# EAGLE board locux sodimm (EAGLE 6.1)
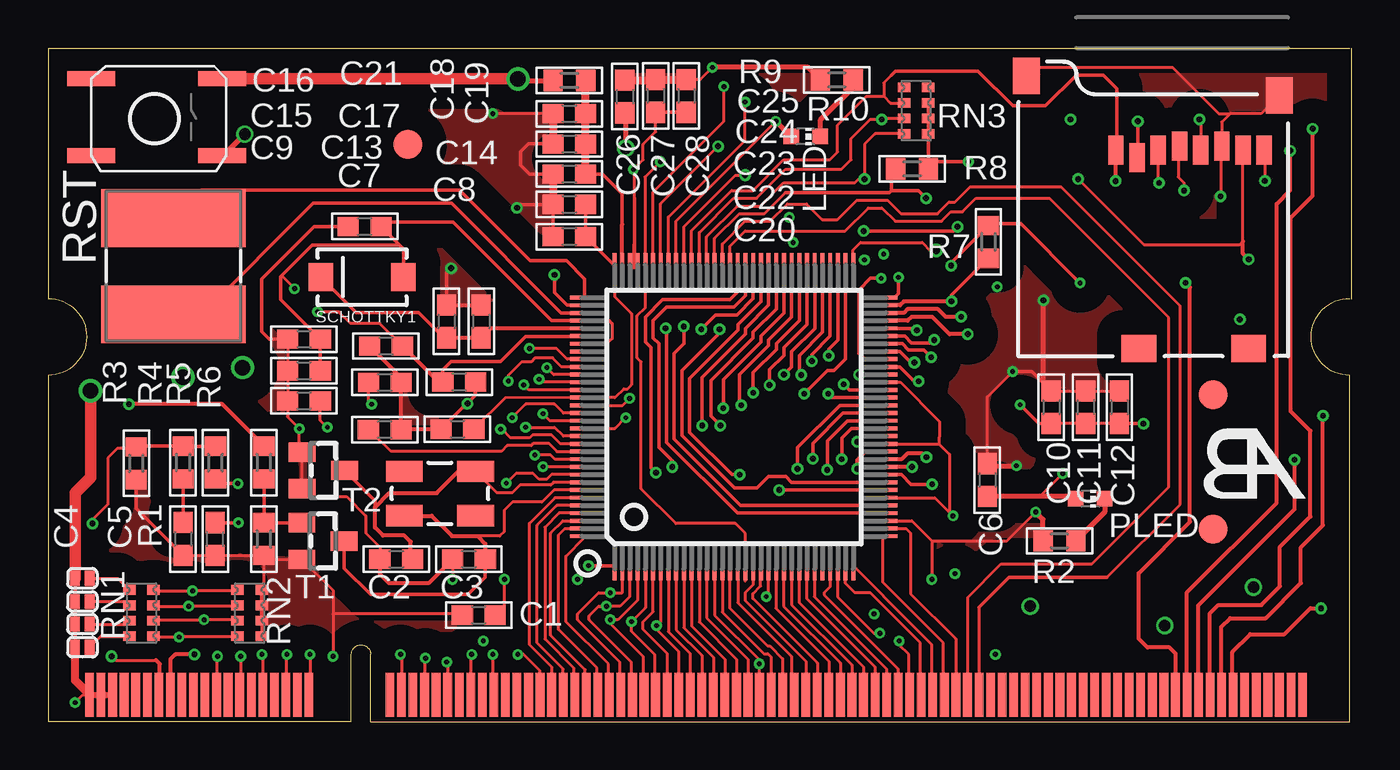
[diagram p2: board, top side]
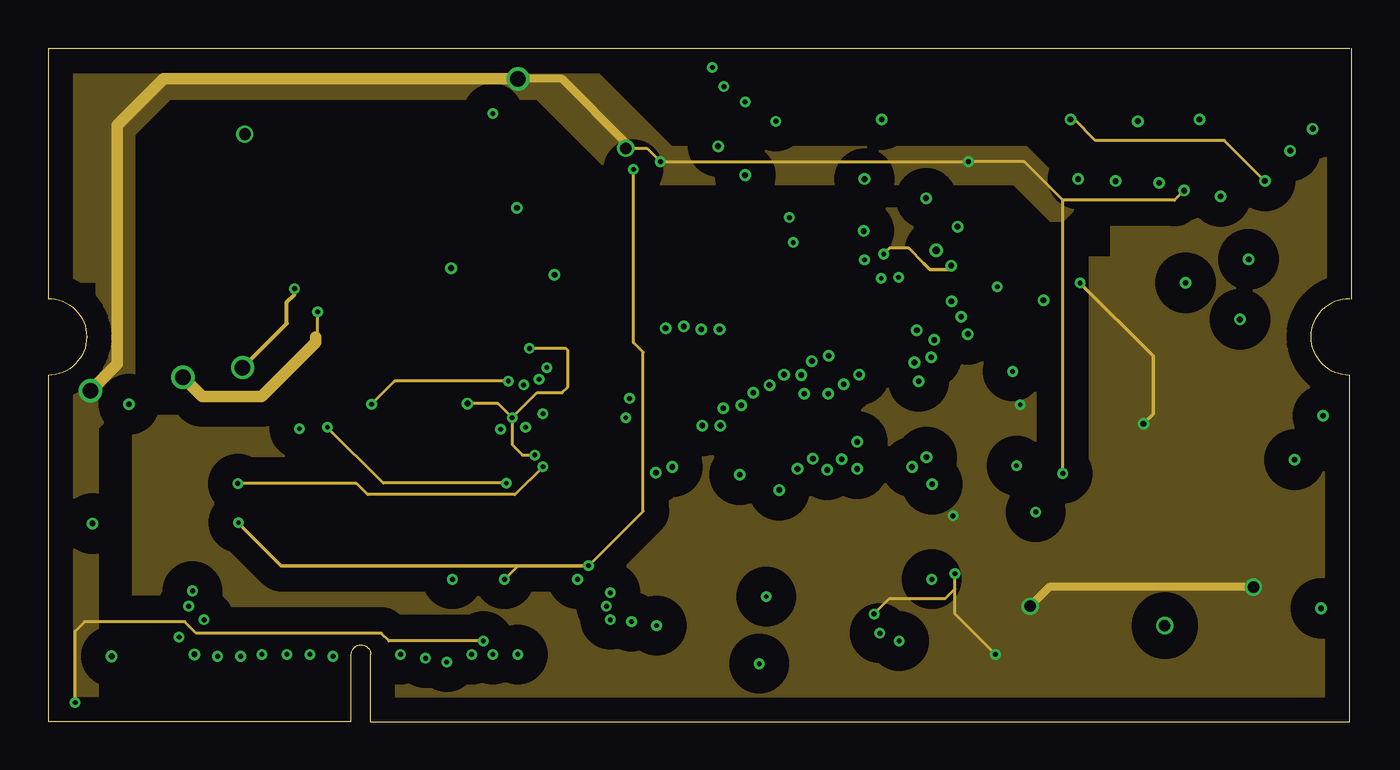
[diagram p3: board, inner layer POWER]
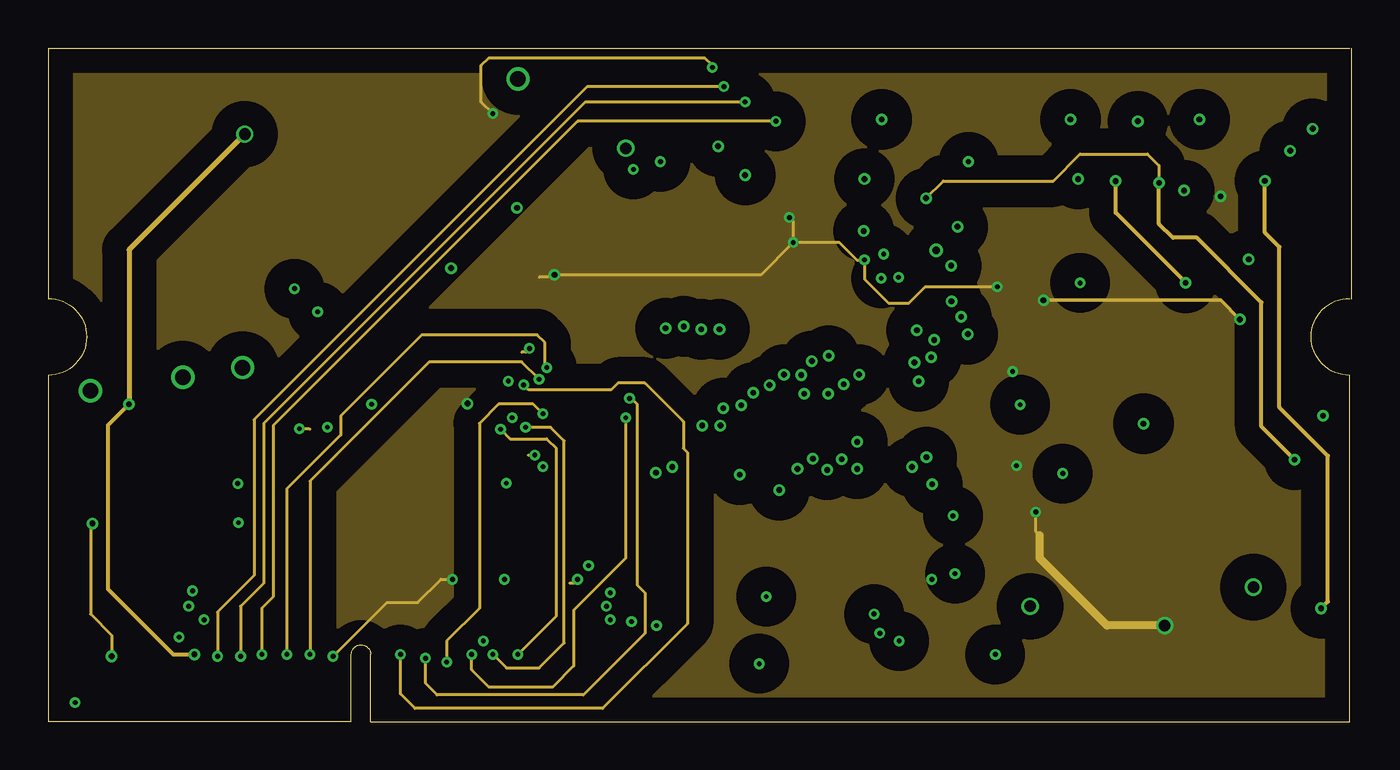
[diagram p4: board, inner layer GND]
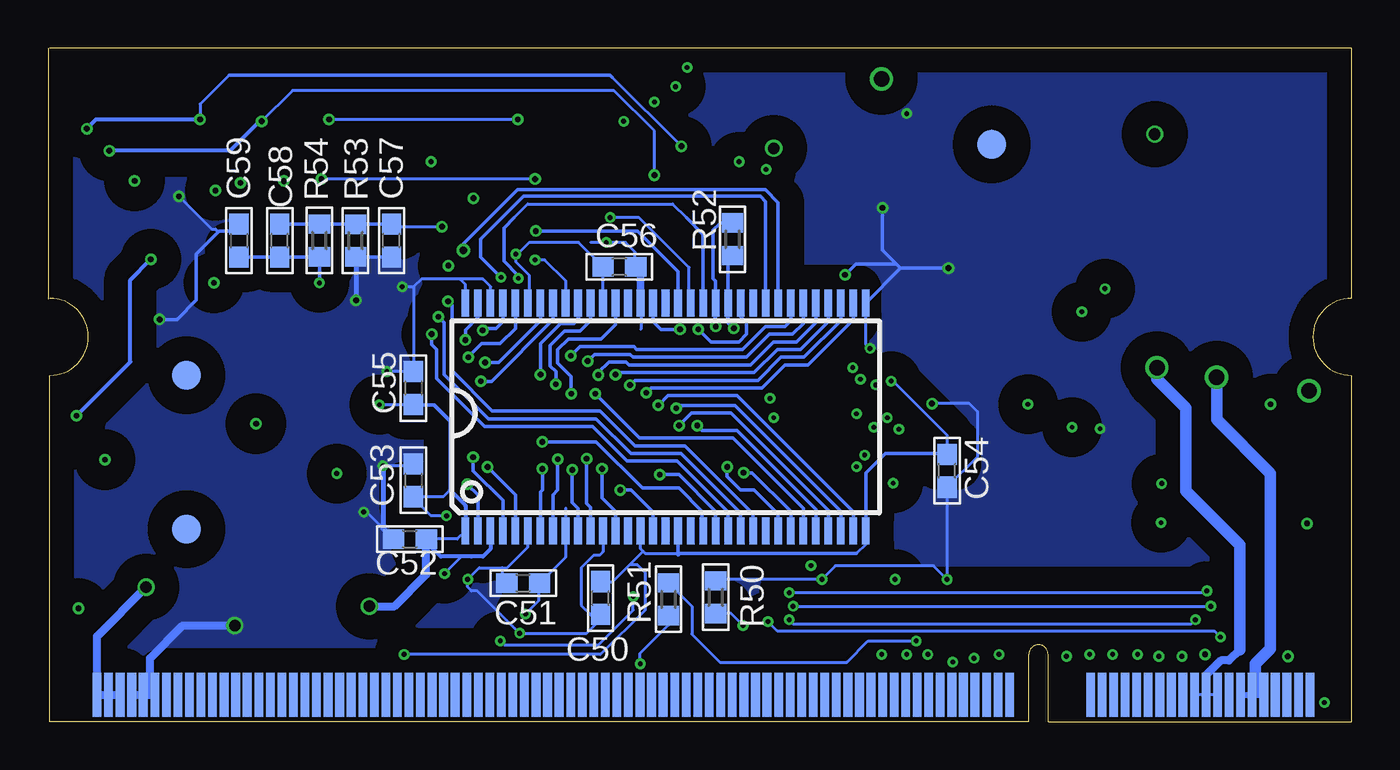
[diagram p5: board, bottom side, seen from below]

Size 67.69 x 35 mm. Coordinates in mm from the lower left corner, seen from the top.
Copper layers (1+2*15+16): SIG1 0.035mm / dielectric 0.5mm / POWER 0.035mm / dielectric 0.5mm / GND 0.035mm / dielectric 0.5mm / SIG2 0.035mm
Design rules: minimum track width 0.0051mm, minimum drill 0.25mm, track to track 0.1499mm, track to pad 0.1499mm, pad to pad 0.1499mm, via to via 0.1499mm, smd to smd 0.1mm, copper to edge 0.25mm, drill to drill 8mil, minimum pad ring 6mil, minimum via ring 0.15mm, stop-mask expansion 4mil, vias tented up to drill 25mil, thermal gap 0mil
Net classes: 1 pwr: width 0.15 mm, clearance 0.15 mm
tRestrict: 1 lines

## Footprints (pad centres in the part's own frame; a part is rotated, then mirrored left to right if it is on the bottom)
C0603 = smd 1.1 x 1: 1 -0.85,0; 2 0.85,0
SJ_1_SMALLER = smd 0.508 x 0.762: 1 -0.381,0; 2 0.381,0
FIDUCIAL-1.5X3 = smd 1.5 x 1.5: 1 0,0
NPI75C = smd 3 x 7.5: 1 -2.5,0; 2 2.5,0
CHIP-LED0603 = smd 0.8 x 0.8: A 0,-0.75; C 0,0.75
CRYSTAL-4PIN = smd 1.9 x 1.1: 1 -1.85,-1.15; 2 1.85,-1.15; 3 1.85,1.15; 4 -1.85,1.15
R0603 = smd 1 x 1.1: 1 -0.85,0; 2 0.85,0
0603-ARC = smd 0.5 x 0.65: 1 -1.2,-0.625; 2 -0.4,-0.625; 3 0.4,-0.625; 4 1.2,-0.625; 5 1.2,0.625; 6 0.4,0.625; 7 -0.4,0.625; 8 -1.2,0.625
SWITCH_SMD = smd 2.5 x 0.762: 1 -2.54,2.73; 2 4.26,2.73; 3 -2.54,-1.27; 4 4.26,-1.27
SCHOTTKY_SMA = smd 1.27 x 1.47: A -2.15,0; C 2.15,0
SODIMM_BOARD_SMALLER = smd 0.45 x 2.3: 1 2.15,1.4; 3 2.75,1.4; 5 3.35,1.4; 7 3.95,1.4; 9 4.55,1.4; 11 5.15,1.4; 13 5.75,1.4; 15 6.35,1.4; 17 6.95,1.4; 19 7.55,1.4; 21 8.15,1.4; 23 8.75,1.4; 25 9.35,1.4; 27 9.95,1.4; 29 10.55,1.4; 31 11.15,1.4; 33 11.75,1.4; 35 12.35,1.4; 37 12.95,1.4; 39 13.55,1.4; 41 17.75,1.4; 43 18.35,1.4; 45 18.95,1.4; 47 19.55,1.4; 49 20.15,1.4; 51 20.75,1.4; 53 21.35,1.4; 55 21.95,1.4; 57 22.55,1.4; 59 23.15,1.4; 61 23.75,1.4; 63 24.35,1.4; 65 24.95,1.4; 67 25.55,1.4; 69 26.15,1.4; 71 26.75,1.4; 73 27.35,1.4; 75 27.95,1.4; 77 28.55,1.4; 79 29.15,1.4; 81 29.75,1.4; 83 30.35,1.4; 85 30.95,1.4; 87 31.55,1.4; 89 32.15,1.4; 91 32.75,1.4; 93 33.35,1.4; 95 33.95,1.4; 97 34.55,1.4; 99 35.15,1.4; 101 35.75,1.4; 103 36.35,1.4; 105 36.95,1.4; 107 37.55,1.4; 109 38.15,1.4; 111 38.75,1.4; 113 39.35,1.4; 115 39.95,1.4; 117 40.55,1.4; 119 41.15,1.4; 121 41.75,1.4; 123 42.35,1.4; 125 42.95,1.4; 127 43.55,1.4; 129 44.15,1.4; 131 44.75,1.4; 133 45.35,1.4; 135 45.95,1.4; 137 46.55,1.4; 139 47.15,1.4; 141 47.75,1.4; 143 48.35,1.4; 145 48.95,1.4; 147 49.55,1.4; 149 50.15,1.4; 151 50.75,1.4; 153 51.35,1.4; 155 51.95,1.4; 157 52.55,1.4; 159 53.15,1.4; 161 53.75,1.4; 163 54.35,1.4; 165 54.95,1.4; 167 55.55,1.4; 169 56.15,1.4; 171 56.75,1.4; 173 57.35,1.4; 175 57.95,1.4; 177 58.55,1.4; 179 59.15,1.4; 181 59.75,1.4; 183 60.35,1.4; 185 60.95,1.4; 187 61.55,1.4; 189 62.15,1.4; 191 62.75,1.4; 193 63.35,1.4; 195 63.95,1.4; 197 64.55,1.4; 199 65.15,1.4 | smd 0.45 x 2.3 bottom: 2 2.15,1.4; 4 2.75,1.4; 6 3.35,1.4; 8 3.95,1.4; 10 4.55,1.4; 12 5.15,1.4; 14 5.75,1.4; 16 6.35,1.4; 18 6.95,1.4; 20 7.55,1.4; 22 8.15,1.4; 24 8.75,1.4; 26 9.35,1.4; 28 9.95,1.4; 30 10.55,1.4; 32 11.15,1.4; 34 11.75,1.4; 36 12.35,1.4; 38 12.95,1.4; 40 13.55,1.4; 42 17.75,1.4; 44 18.35,1.4; 46 18.95,1.4; 48 19.55,1.4; 50 20.15,1.4; 52 20.75,1.4; 54 21.35,1.4; 56 21.95,1.4; 58 22.55,1.4; 60 23.15,1.4; 62 23.75,1.4; 64 24.35,1.4; 66 24.95,1.4; 68 25.55,1.4; 70 26.15,1.4; 72 26.75,1.4; 74 27.35,1.4; 76 27.95,1.4; 78 28.55,1.4; 80 29.15,1.4; 82 29.75,1.4; 84 30.35,1.4; 86 30.95,1.4; 88 31.55,1.4; 90 32.15,1.4; 92 32.75,1.4; 94 33.35,1.4; 96 33.95,1.4; 98 34.55,1.4; 100 35.15,1.4; 102 35.75,1.4; 104 36.35,1.4; 106 36.95,1.4; 108 37.55,1.4; 110 38.15,1.4; 112 38.75,1.4; 114 39.35,1.4; 116 39.95,1.4; 118 40.55,1.4; 120 41.15,1.4; 122 41.75,1.4; 124 42.35,1.4; 126 42.95,1.4; 128 43.55,1.4; 130 44.15,1.4; 132 44.75,1.4; 134 45.35,1.4; 136 45.95,1.4; 138 46.55,1.4; 140 47.15,1.4; 142 47.75,1.4; 144 48.35,1.4; 146 48.95,1.4; 148 49.55,1.4; 150 50.15,1.4; 152 50.75,1.4; 154 51.35,1.4; 156 51.95,1.4; 158 52.55,1.4; 160 53.15,1.4; 162 53.75,1.4; 164 54.35,1.4; 166 54.95,1.4; 168 55.55,1.4; 170 56.15,1.4; 172 56.75,1.4; 174 57.35,1.4; 176 57.95,1.4; 178 58.55,1.4; 180 59.15,1.4; 182 59.75,1.4; 184 60.35,1.4; 186 60.95,1.4; 188 61.55,1.4; 190 62.15,1.4; 192 62.75,1.4; 194 63.35,1.4; 196 63.95,1.4; 198 64.55,1.4; 200 65.15,1.4
SOT23 = smd 1 x 1.4: 1 -0.95,-1.1; 2 0.95,-1.1; 3 0,1.1
TQFP128LD = smd 0.2 x 1.5: 1 -6.2,-7.75; 2 -5.8,-7.75; 3 -5.4,-7.75; 4 -5,-7.75; 5 -4.6,-7.75; 6 -4.2,-7.75; 7 -3.8,-7.75; 8 -3.4,-7.75; 9 -3,-7.75; 10 -2.6,-7.75; 11 -2.2,-7.75; 12 -1.8,-7.75; 13 -1.4,-7.75; 14 -1,-7.75; 15 -0.6,-7.75; 16 -0.2,-7.75; 17 0.2,-7.75; 18 0.6,-7.75; 19 1,-7.75; 20 1.4,-7.75; 21 1.8,-7.75; 22 2.2,-7.75; 23 2.6,-7.75; 24 3,-7.75; 25 3.4,-7.75; 26 3.8,-7.75; 27 4.2,-7.75; 28 4.6,-7.75; 29 5,-7.75; 30 5.4,-7.75; 31 5.8,-7.75; 32 6.2,-7.75; 65 6.2,7.75; 66 5.8,7.75; 67 5.4,7.75; 68 5,7.75; 69 4.6,7.75; 70 4.2,7.75; 71 3.8,7.75; 72 3.4,7.75; 73 3,7.75; 74 2.6,7.75; 75 2.2,7.75; 76 1.8,7.75; 77 1.4,7.75; 78 1,7.75; 79 0.6,7.75; 80 0.2,7.75; 81 -0.2,7.75; 82 -0.6,7.75; 83 -1,7.75; 84 -1.4,7.75; 85 -1.8,7.75; 86 -2.2,7.75; 87 -2.6,7.75; 88 -3,7.75; 89 -3.4,7.75; 90 -3.8,7.75; 91 -4.2,7.75; 92 -4.6,7.75; 93 -5,7.75; 94 -5.4,7.75; 95 -5.8,7.75; 96 -6.2,7.75 | smd 1.5 x 0.2: 33 7.75,-6.2; 34 7.75,-5.8; 35 7.75,-5.4; 36 7.75,-5; 37 7.75,-4.6; 38 7.75,-4.2; 39 7.75,-3.8; 40 7.75,-3.4; 41 7.75,-3; 42 7.75,-2.6; 43 7.75,-2.2; 44 7.75,-1.8; 45 7.75,-1.4; 46 7.75,-1; 47 7.75,-0.6; 48 7.75,-0.2; 49 7.75,0.2; 50 7.75,0.6; 51 7.75,1; 52 7.75,1.4; 53 7.75,1.8; 54 7.75,2.2; 55 7.75,2.6; 56 7.75,3; 57 7.75,3.4; 58 7.75,3.8; 59 7.75,4.2; 60 7.75,4.6; 61 7.75,5; 62 7.75,5.4; 63 7.75,5.8; 64 7.75,6.2; 97 -7.75,6.2; 98 -7.75,5.8; 99 -7.75,5.4; 100 -7.75,5; 101 -7.75,4.6; 102 -7.75,4.2; 103 -7.75,3.8; 104 -7.75,3.4; 105 -7.75,3; 106 -7.75,2.6; 107 -7.75,2.2; 108 -7.75,1.8; 109 -7.75,1.4; 110 -7.75,1; 111 -7.75,0.6; 112 -7.75,0.2; 113 -7.75,-0.2; 114 -7.75,-0.6; 115 -7.75,-1; 116 -7.75,-1.4; 117 -7.75,-1.8; 118 -7.75,-2.2; 119 -7.75,-2.6; 120 -7.75,-3; 121 -7.75,-3.4; 122 -7.75,-3.8; 123 -7.75,-4.2; 124 -7.75,-4.6; 125 -7.75,-5; 126 -7.75,-5.4; 127 -7.75,-5.8; 128 -7.75,-6.2
MICRO-SD-SOCKET-PP = smd 0.8 x 1.5: 1 -8.94,10.7; 2 -7.84,10.3; 3 -6.74,10.7; 4 -5.64,10.9; 5 -4.54,10.7; 6 -3.44,10.9; 7 -2.34,10.7; 8 -1.24,10.7 | smd 1.8 x 1.4: CD1 -2.05,0.4; CD2 -7.75,0.4 | smd 1.4 x 1.9: GND1 -13.6,14.55; GND3 -0.45,13.55
66TSOP-II = smd 0.4 x 1.4: 1 -10.4,-5.925; 2 -9.75,-5.925; 3 -9.1,-5.925; 4 -8.45,-5.925; 5 -7.8,-5.925; 6 -7.15,-5.925; 7 -6.5,-5.925; 8 -5.85,-5.925; 9 -5.2,-5.925; 10 -4.55,-5.925; 11 -3.9,-5.925; 12 -3.25,-5.925; 13 -2.6,-5.925; 14 -1.95,-5.925; 15 -1.3,-5.925; 16 -0.65,-5.925; 17 0,-5.925; 18 0.65,-5.925; 19 1.3,-5.925; 20 1.95,-5.925; 21 2.6,-5.925; 22 3.25,-5.925; 23 3.9,-5.925; 24 4.55,-5.925; 25 5.2,-5.925; 26 5.85,-5.925; 27 6.5,-5.925; 28 7.15,-5.925; 29 7.8,-5.925; 30 8.45,-5.925; 31 9.1,-5.925; 32 9.75,-5.925; 33 10.4,-5.925; 34 10.4,5.925; 35 9.75,5.925; 36 9.1,5.925; 37 8.45,5.925; 38 7.8,5.925; 39 7.15,5.925; 40 6.5,5.925; 41 5.85,5.925; 42 5.2,5.925; 43 4.55,5.925; 44 3.9,5.925; 45 3.25,5.925; 46 2.6,5.925; 47 1.95,5.925; 48 1.3,5.925; 49 0.65,5.925; 50 0,5.925; 51 -0.65,5.925; 52 -1.3,5.925; 53 -1.95,5.925; 54 -2.6,5.925; 55 -3.25,5.925; 56 -3.9,5.925; 57 -4.55,5.925; 58 -5.2,5.925; 59 -5.85,5.925; 60 -6.5,5.925; 61 -7.15,5.925; 62 -7.8,5.925; 63 -8.45,5.925; 64 -9.1,5.925; 65 -9.75,5.925; 66 -10.4,5.925

## Placement (x,y rotation side)
C1  .1u  [C0603]  22.36,5.54 0 top
C2  22p  [C0603]  18.08,8.45 0 top
C3  22p  [C0603]  21.86,8.45 0 top
C4  100nF  [C0603]  7.01,9.5 270 top
C5  .1u  [C0603]  8.68,9.49 90 top
C6  .1u  [C0603]  48.78,12.56 270 top
C7  1u  [C0603]  17.48,15.18 180 top
C8  1u  [C0603]  21.26,15.2 0 top
C9  .1u  [C0603]  13.29,16.67 0 top
C10  .1u  [C0603]  52.1,16.34 270 top
C11  .1u  [C0603]  53.89,16.34 270 top
C12  .1u  [C0603]  55.64,16.34 270 top
C13  1u  [C0603]  17.49,17.63 180 top
C14  10u  [C0603]  21.35,17.65 180 top
C15  1u  [C0603]  13.29,18.24 0 top
C16  10u  [C0603]  13.29,19.88 0 top
C17  .1u  [C0603]  17.55,19.52 0 top
C18  10u  [C0603]  20.69,20.8 270 top
C19  10u  [C0603]  22.49,20.8 270 top
C20  10u  [C0603]  27.07,25.2 0 top
C21  .1u  [C0603]  16.44,25.73 0 top
C22  1u  [C0603]  27.07,26.88 0 top
C23  10u  [C0603]  27.07,28.45 0 top
C24  1u  [C0603]  27.07,30.01 0 top
C25  .1u  [C0603]  27.07,31.59 0 top
C26  .1u  [C0603]  29.95,32.48 270 top
C27  1u  [C0603]  31.55,32.51 270 top
C28  10u  [C0603]  33.15,32.51 270 top
C50  .1u  [C0603]  39,6.43 90 bottom
C51  .1u  [C0603]  43.02,7.2 0 bottom
C52  .1u  [C0603]  48.9,9.49 0 bottom
C53  .1u  [C0603]  48.72,12.54 270 bottom
C54  .1u  [C0603]  21,13.04 90 bottom
C55  .1u  [C0603]  48.72,17.34 270 bottom
C56  .1u  [C0603]  38.02,23.64 180 bottom
C57  .1u  [C0603]  49.85,25 90 bottom
C58  .1u  [C0603]  55.66,25 90 bottom
C59  .1u  [C0603]  57.78,25 270 bottom
D00_H  Close  [SJ_1_SMALLER]  1.78,7.45 180 top
D01_H  Open  [SJ_1_SMALLER]  1.78,6.25 180 top
D02_H  Open  [SJ_1_SMALLER]  1.78,5.07 180 top
D03_H  Close  [SJ_1_SMALLER]  1.78,3.87 180 top
JP1  FIDUCIAL1.5X3  [FIDUCIAL-1.5X3]  60.5,10 0 top
JP2  FIDUCIAL1.5X3  [FIDUCIAL-1.5X3]  60.5,17 0 top
JP3  FIDUCIAL1.5X3  [FIDUCIAL-1.5X3]  18.68,30 0 top
JP50  FIDUCIAL1.5X3  [FIDUCIAL-1.5X3]  60.5,10 0 bottom
JP51  FIDUCIAL1.5X3  [FIDUCIAL-1.5X3]  60.5,18 0 bottom
JP52  FIDUCIAL1.5X3  [FIDUCIAL-1.5X3]  18.68,30 0 bottom
L1  22uH/1.5A/CD53  [NPI75C]  6.51,23.67 90 top
LED  [CHIP-LED0603]  39.34,30.4 270 top
PLED  [CHIP-LED0603]  54.13,11.58 270 top
Q1  Q24.000MHz/HC-49SM/SMD/20ppm/20pF  [CRYSTAL-4PIN]  20.35,11.86 180 top
R1  2.2k  [R0603]  11.21,9.49 270 top
R2  560R  [R0603]  52.53,9.4 0 top
R3  100K  [R0603]  4.58,13.43 270 top
R4  1K  [R0603]  7.01,13.47 270 top
R5  1K  [R0603]  8.69,13.46 270 top
R6  2.2k  [R0603]  11.21,13.47 90 top
R7  10K  [R0603]  48.84,24.93 270 top
R8  10K  [R0603]  44.88,28.72 0 top
R9  0R(Board_Mounted)  [R0603]  27.07,33.32 0 top
R10  560R  [R0603]  40.97,33.35 0 top
R50  47K  [R0603]  33.02,6.47 90 bottom
R51  47K  [R0603]  35.47,6.37 270 bottom
R52  110R  [R0603]  32.14,25.07 90 bottom
R53  1K  [R0603]  51.73,25 90 bottom
R54  1K  [R0603]  53.6,25 90 bottom
RN1  4.7k  [0603-ARC]  4.85,5.65 90 top
RN2  47k  [0603-ARC]  10.47,5.65 270 top
RN3  100K  [0603-ARC]  45.09,31.75 90 top
RST  [SWITCH_SMD]  4.78,30.68 0 top
SCHOTTKY1  [SCHOTTKY_SMA]  16.31,23.1 180 top
SODIMM1  [SODIMM_BOARD_SMALLER]  0,0 0 top
T1  BC846B  [SOT23]  14.28,9.39 270 top
T2  BC846B  [SOT23]  14.3,13.06 270 top
U1  MCIMX233CAG4C  [TQFP128LD]  35.62,15.84 0 top
U2  USD-SOCKETNEW  [MICRO-SD-SOCKET-PP]  64.4,19 0 top
U50  HY5DU121622D(L)T(P)-J  [66TSOP-II]  35.62,15.84 0 bottom

## Tracks (layer width: path | path; a pad name or v marks a point on that pad's centre or on a via)
2.5V  (via drill 0.25 pad 0.25, 0.3 pad 0.3, 0.6 pad 0.61)
  SIG1 0.15: C12.2 C11.2 C10.2 | v16.8,16.5 16.64,16.66 C13.2 | 23.9,17.8 v23.9,17.7 23.9,18 24.6,18.7 25.1,18.7 25.3,18.9 26.2,18.9 26.66,18.44 U1.106 | U1.38 46.06,11.64 v47,10.7 46.82,10.88 46.82,13.9 46.28,14.44 | U1.45 46.28,14.44 | U1.53 44.26,17.64 46.3,15.6 46.3,14.8 46.28,14.78 46.28,14.44
  SIG1 0.17: v53.6,22.8 50.52,25.88 48.94,25.88 R7.1 46.9,23.84 v46.9,23.7 | v56.89,15.49 C12.2 | v50.49,16.47 51.47,15.49 C10.2
  SIG1 0.2: U1.106 27.92,18.44
  POWER 0.15: v23.9,17.7 18,17.7 v16.8,16.5 | v42.9,5.6 43.7,6.4 46.6,6.4 47.1,6.9 | v49.2,3.5 47.1,5.6 47.1,6.9 | 47.1,6.9 v47.1,7.7 | 45.5,23.8 44.7,24.6 43.7,24.6 v43.4,24.3
  POWER 0.17: v53.6,22.8 57.4,19 57.4,16 v56.89,15.49 | 45.5,23.8 45.8,23.5 46.7,23.5 v46.9,23.7
  POWER 0.406: v62.6,7 52,7 v51,6
  SIG2 0.15: 46.82,12.04 47.17,11.69 C53.2 48.72,11.62 47.8,10.7 v47,10.7 | C55.2 48.74,16.47 v50.49,16.47 | v23.9,17.7 23.8,17.7 21,14.9 C54.2 | U50.33 25.22,9.22 25.7,8.74 | 34.97,8.74 36.67,8.74 36.79,8.86 | U50.1 46.45,9.49 C52.2 | 40.8,11.1 40.8,9.94 U50.9 40.82,8.55 C51.2 42.2,7.2 42.2,6.3 v42.9,5.6 | U50.55 C56.2 40.13,24.9 42.7,24.9 43.3,24.3 v43.4,24.3 43.4,23.9 42.7,23.2 42.7,21.84 U50.61 | v47.1,7.7 46.22,8.58 45.7,8.58 | 36.79,8.86 36.92,8.99 U50.15 | v49.2,3.5 39,3.5 36.7,5.8 36.7,7.77 37.08,8.15 37.5,8.15 | C50.2 38.37,7.28 37.5,8.15 | 37.5,8.15 36.79,8.86
  SIG2 0.17: U50.33 25.22,12.94 24.21,13.95 21.06,13.95 C54.2 | U50.18 34.97,8.74 25.7,8.74 | C59.2 C58.1 R54.1 v53.6,22.8
  SIG2 0.2: U50.1 46.02,11.24 46.82,12.04 46.82,15.64 47.63,16.45 C55.2 | 34.97,8.74 34.97,8.69 | U50.3 44.72,8.97 45.11,8.58 45.7,8.58 47.3,8.58 48.05,9.33 C52.2
  SIG2 0.406: v62.6,7 65.15,4.45 SODIMM1.200 SODIMM1.198 SODIMM1.196 | C52.2 48.05,7.65 49.7,6 v51,6
  pour POWER (isolate 1.27): 66.67,0 66.67,0.64 17.78,0.64 17.78,4.45 15.24,4.45 15.24,0.64 4.45,0.64 4.45,15.88 22.86,15.88 22.86,26.67 48.9,26.67 51.44,24.13 55.24,24.13 55.24,27.94 52.07,31.11 33.02,31.11 30.48,33.66 31.75,34.92 67.94,34.92 67.94,22.23 65.41,22.23 65.41,17.78 67.31,17.78 67.31,0
3.3V  (via drill 0.25 pad 0.25, 0.3 pad 0.3, 0.6 pad 0.6, 0.8 pad 0.8)
  SIG1 0.15: v31.8,29.1 31,28.3 31,23.61 U1.92 31.02,21.52 30.6,21.1 30.6,18.9 30.8,18.7 30.8,12.1 32.6,10.3 35.7,10.3 36.22,9.78 U1.18 36.2,8.07 36.2,7.3 | C6.2 51.51,11.71 v52.7,12.9 | v1.4,1 1.8,1.4 SODIMM1.3 | U2.4 58.7,29.84 58.7,28.3 59,28 v59,27.6
  SIG1 0.17: D03_H.2 D02_H.2 D01_H.2 D00_H.2 | RN3.3 RN3.2 RN3.1 45.73,30.53 R8.2 46.1,29.1 v47.8,29.1
  SIG1 0.25: D00_H.2 | v24.4,33.4 24.48,33.32 R9.1 | C26.2 30,31.58 v30,29.8
  SIG1 0.254: PLED.A 53.25,11.71 C6.2
  SIG1 0.305: SODIMM1.1 SODIMM1.3 SODIMM1.5
  SIG1 0.406: SODIMM1.1 1.4,2.15 D03_H.2
  SIG1 0.6: D00_H.2 1.4,11.9 2.2,12.7 v2.2,17.2
  SIG1 0.61: 24.28,33.4 v24.4,33.4 RST.2
  POWER 0.15: v30,29.8 31.1,29.8 v31.8,29.1 v47.8,29.1 50.7,29.1 52.7,27.1 | v52.7,12.9 52.7,27.1 | v22.6,4.2 17.7,4.2 17.3,4.6 7.7,4.6 7.1,5.2 1.9,5.2 1.4,4.7 v1.4,1 1.4,1.3 | v59,27.6 58.5,27.1 52.7,27.1
  POWER 0.406: v24.4,33.4 26.7,33.4 30,30.1 v30,29.8
  POWER 0.6: v2.2,17.2 3.6,18.6 3.6,31 6,33.4 v24.4,33.4
  SIG2 0.15: v22.6,4.2 25.1,4.2 26.2,3.1 32.8,3.1 34.25,4.55 34.25,6 R51.1
  pour POWER (isolate 1.27): 2.54,0 0,0 0,17.78 2.54,17.78 2.54,22.86 0.64,22.86 0.64,34.29 27.94,34.29 32.38,29.84 50.8,29.84 53.34,27.3 53.34,26.67 52.7,26.04 52.07,26.04 50.16,27.94 29.84,27.94 25.4,32.38 6.35,32.38 4.45,30.48 4.45,17.14 2.54,15.24
+4V  (via drill 0.25 pad 0.25, 0.8 pad 0.81)
  SIG1 0.15: U1.100 29.16,20.84 29.3,20.7 29.3,19.9 29.04,19.64 U1.103 | v12.8,22.5 12.17,23.13 12.17,23.23
  SIG1 0.17: U1.100 26.14,20.84 21.03,25.95 17.51,25.95 C21.2 18.25,24.77 | 18.25,24.77 18.46,24.56 SCHOTTKY1.A | 18.25,24.77 13.71,24.77 12.17,23.23 12.08,23.14 12.08,21.94 C16.2 C15.2
  POWER 0.2: v10.1,18.4 12.4,20.7 12.4,21.8 12.8,22.2 v12.8,22.5
  SIG2 0.15: SODIMM1.18 SODIMM1.20 SODIMM1.22
  SIG2 0.406: 5.8,3.75 6.36,3.19 6.77,3.19 7.55,2.41 SODIMM1.20
  SIG2 0.61: 5.8,3.75 5.8,9.2 8.6,12 8.6,16.3 10.1,17.8 v10.1,18.4
+5V  (via drill 0.25 pad 0.25, 0.8 pad 0.81)
  SIG1 0.15: C17.2 17.22,20.7 15.7,20.7 15.1,21.3 v14,21.3
  SIG1 0.17: U1.102 27.85,20.02 24.8,20.01 23.51,18.72 20.94,18.72 20.5,18.28 C14.2
  SIG1 0.2: C17.2 20.27,17.65 C14.2
  POWER 0.15: 13.9,20 14,20.1 v14,21.3
  POWER 0.61: v7,17.9 8,16.9 11.1,16.9 13.9,19.7 13.9,20
  SIG2 0.305: SODIMM1.14 SODIMM1.12 SODIMM1.10
  SIG2 0.406: 5,2.15 5,1.55 SODIMM1.12
  SIG2 0.61: v7,17.9 7,15.7 4.2,12.9 4.2,3.8 5,3 5,2.15
A0  (via drill 0.3)
  SIG1 0.17: U1.76 37.42,21.64 36.22,20.44 36.22,20.14 33.97,17.89 v33.97,15.39
  SIG2 0.17: U50.29 27.82,11.04 31.92,15.14 33.72,15.14 v33.97,15.39
A1  (via drill 0.3)
  SIG1 0.17: U1.75 37.82,21.44 36.62,20.24 36.62,19.94 34.42,17.74 34.42,15.89 v34.92,15.39
  SIG2 0.17: U50.30 27.17,10.99 32.22,16.04 34.27,16.04 v34.92,15.39
A2  (via drill 0.3)
  SIG1 0.17: U1.74 38.22,21.24 37.02,20.04 37.02,19.74 35.07,17.79 v35.07,16.29
  SIG2 0.17: U50.31 26.52,10.94 32.02,16.44 34.92,16.44 v35.07,16.29
A3  (via drill 0.3)
  SIG1 0.17: U1.73 38.62,21.04 37.42,19.84 37.42,19.54 35.92,18.04 35.92,16.52
  SIG1 0.2: v35.99,16.44 35.92,16.52
  SIG2 0.17: U50.32 25.87,10.89 31.92,16.94 35.49,16.94 v35.99,16.44
A4  (via drill 0.3)
  SIG1 0.17: v36.62,17.09 36.62,18.14 37.82,19.34 37.82,19.64 39.02,20.84 U1.72
  SIG2 0.17: v36.62,17.09 36.37,17.34 30.62,17.34 29.42,18.54 28.22,18.54 25.87,20.89 U50.35
A5  (via drill 0.3)
  SIG1 0.17: v37.47,17.49 37.47,18.29 38.22,19.04 38.22,19.44 39.42,20.64 U1.71
  SIG2 0.17: v37.47,17.49 37.22,17.74 30.82,17.74 29.62,18.94 28.42,18.94 26.52,20.84 U50.36
A6  (via drill 0.3)
  SIG1 0.17: v38.22,18.04 38.62,18.44 38.62,19.24 39.82,20.44 U1.70
  SIG2 0.17: v38.22,18.04 38.12,18.14 31.02,18.14 29.82,19.34 28.62,19.34 27.17,20.79 U50.37
A7  (via drill 0.3)
  SIG1 0.17: v39.12,18.02 39.12,18.14 39.02,18.24 39.02,19.04 40.22,20.24 U1.69
  SIG2 0.17: v39.12,18.02 39.12,18.14 38.57,18.69 37.67,18.69 37.52,18.54 31.22,18.54 30.02,19.74 28.82,19.74 27.82,20.74 U50.38
A8  (via drill 0.3)
  SIG1 0.17: v39.67,18.74 39.67,19.09 40.62,20.04 U1.68
  SIG2 0.17: v39.67,18.74 39.32,19.09 37.47,19.09 37.32,18.94 31.42,18.94 30.22,20.14 29.02,20.14 28.47,20.69 U50.39
A9  (via drill 0.3)
  SIG1 0.17: v40.55,19.02 40.55,19.36 41.02,19.84 U1.67
  SIG2 0.17: v40.55,19.02 40.07,19.49 37.27,19.49 37.12,19.34 31.62,19.34 30.42,20.54 29.42,20.54 29.12,20.84 U50.40
A10  (via drill 0.3)
  SIG1 0.17: U1.66 41.42,18.84 40.82,18.24 40.47,18.24 v39.27,17.04
  SIG2 0.17: U50.28 28.47,11.09 32.12,14.74 36.97,14.74 v39.27,17.04
A11  (via drill 0.4)
  SIG1 0.15: U1.65 41.8,23.61 41.8,24.5 42.2,24.9 45.4,24.9 45.81,24.49 v46.12,24.49
  SIG2 0.17: v46.12,24.49 46.12,24.84 43.31,27.65 30.44,27.65 29.77,26.98 U50.41
A12  (via drill 0.25 pad 0.25)
  SIG1 0.17: U1.64 43.97,22.04 44.17,22.24 v44.17,23.09
  SIG2 0.17: v44.17,23.09 45.22,24.14 45.22,25.07 42.99,27.3 30.69,27.3 30.42,27.03 U50.42
AUART1_RXD
  SIG1 0.15: SODIMM1.79 29.1,1.45 29.1,3 26.9,5.2 26.9,8.6 27.87,9.57 U1.128
AUART1_TXD
  SIG1 0.15: SODIMM1.77 28.5,1.45 28.5,2.8 26.5,4.8 26.5,9.7 26.84,10.04 U1.127
BA0  (via drill 0.3)
  SIG1 0.17: U1.79 36.22,22.14 35.62,21.54 32.12,21.54 31.42,20.84 31.42,19.94 31.72,19.64 31.72,14.24 32.42,13.54 v32.42,13.24
  SIG2 0.17: U50.26 29.77,10.79 31.02,12.04 31.72,12.04 32.42,12.74 v32.42,13.24
BA1  (via drill 0.3)
  SIG1 0.17: U1.80 35.82,22.34 35.42,21.94 31.92,21.94 31.02,21.04 31.02,19.74 31.32,19.44 31.32,13.19 v31.57,12.94
  SIG2 0.17: U50.27 29.12,10.94 31.12,12.94 v31.57,12.94
CASN  (via drill 0.3)
  SIG1 0.2: U1.61 44.65,20.84 44.84,21.04 45.92,21.04 46.82,20.14 v47.77,20.14
  SIG2 0.17: U50.22 32.37,10.89 35.02,13.54 37.62,13.54 39.42,15.34 45.02,15.34 47.52,17.84 47.52,19.34 47.77,19.59 v47.77,20.14
CKE  (via drill 0.3)
  SIG1 0.17: v33.92,20.39 34.67,21.14 35.77,21.14 36.62,21.99 U1.78
  SIG2 0.17: v33.92,20.39 33.27,19.74 31.82,19.74 31.42,20.14 31.42,20.77 31.72,21.07 U50.44
CLK  (via drill 0.3)
  SIG1 0.17: v32.07,20.44 32.12,20.39 32.12,14.52 35.8,10.84 U1.36
  SIG1 0.2: U1.36 43.42,10.84
  SIG2 0.17: U50.45 32.37,23.99 R52.1
  SIG2 0.2: U50.45 32.37,20.74 v32.07,20.44
CLKN  (via drill 0.3)
  SIG1 0.17: v33.02,20.54 33.02,19.64 32.52,19.14 32.52,14.69 35.97,11.24 U1.37
  SIG2 0.17: U50.46 33.02,22.89 33.15,23.02 33.15,25.54 32.77,25.92 R52.2
  SIG2 0.2: v33.02,20.54 U50.46
CS  (via drill 0.3)
  SIG1 0.17: v46.92,21.84 46.92,22.16 R7.2
  SIG1 0.2: U1.63 44.24,21.64 44.45,21.84 v46.92,21.84
  SIG2 0.17: U50.24 31.07,10.79 34.62,14.34 37.22,14.34 39.02,16.14 44.62,16.14 46.72,18.24 46.72,21.64 v46.92,21.84
CS_UEXT
  SIG1 0.15: SODIMM1.135 45.9,1.45 45.9,4 43.4,6.5 43.4,6.51 U1.32
D0  (via drill 0.3)
  SIG1 0.17: U1.41 44.32,12.84 44.82,12.34 v45.92,12.34
  SIG2 0.17: v45.92,12.34 45.37,11.79 U50.2
D1  (via drill 0.3)
  SIG1 0.2: U1.43 44.32,13.64 44.62,13.94 45.42,13.94 v45.62,13.74
  SIG2 0.17: v45.62,13.74 45.62,13.04 44.07,11.49 U50.4
D2  (via drill 0.3)
  SIG1 0.2: v44.87,13.24 U1.42
  SIG2 0.17: v44.87,13.24 43.42,11.79 U50.5
D3  (via drill 0.3)
  SIG1 0.17: v42.02,13.14 42.02,13.59 42.47,14.04 U1.44
  SIG2 0.17: v42.02,13.14 42.02,12.04 42.12,11.94 U50.7
D4  (via drill 0.3)
  SIG1 0.17: U1.47 41.72,15.24 41.22,14.74 v41.22,13.64
  SIG2 0.17: v41.22,13.64 41.22,12.04 41.47,11.79 U50.8
D5  (via drill 0.3)
  SIG1 0.17: v40.47,13.09 40.47,14.59 41.52,15.64 U1.48
  SIG2 0.17: U50.10 40.17,11.09 40.47,11.39 v40.47,13.09
D6  (via drill 0.3)
  SIG1 0.17: U1.49 41.3,16.04 39.72,14.46 v39.72,13.66
  SIG2 0.17: U50.11 39.52,11.14 39.72,11.34 v39.72,13.66
D7  (via drill 0.3)
  SIG1 0.17: U1.50 41.12,16.44 38.92,14.24 v38.92,13.14
  SIG2 0.17: U50.13 38.22,10.94 38.92,11.64 v38.92,13.14
D8  (via drill 0.3)
  SIG1 0.17: U1.51 40.72,16.84 v40.52,17.04
  SIG2 0.17: U50.54 38.22,20.64 38.97,19.89 40.67,19.89 41.22,19.34 41.22,18.64 40.52,17.94 v40.52,17.04
D9  (via drill 0.3)
  SIG1 0.17: U1.52 41.62,17.24 v41.32,17.54
  SIG2 0.17: v41.32,17.54 41.32,18.19 41.62,18.49 41.62,19.54 40.87,20.29 40.07,20.29 39.52,20.84 U50.56
D10  (via drill 0.3)
  SIG1 0.17: v42.12,18.04 U1.54
  SIG2 0.17: 40.17,20.89 40.37,20.69 41.07,20.69 42.12,19.64 v42.12,18.04
  SIG2 0.2: U50.57 40.17,20.89
D11  (via drill 0.3)
  SIG1 0.17: v45.22,17.69 44.99,17.69 44.24,18.44 U1.55
  SIG2 0.17: U50.59 41.47,20.89 44.67,17.69 v45.22,17.69
D12  (via drill 0.3)
  SIG1 0.17: U1.57 44.24,19.24 44.82,18.66 v44.99,18.66
  SIG2 0.17: U50.60 42.12,20.84 44.3,18.66 v44.99,18.66
D13  (via drill 0.3)
  SIG1 0.17: U1.58 44.37,19.64 44.7,19.32 45.49,19.32 v45.87,18.94
  SIG2 0.17: v45.87,18.94 45.17,19.64 44.22,19.64 43.42,20.44 U50.62
D14  (via drill 0.3)
  SIG1 0.17: U1.60 45.02,20.44 v45.12,20.34
  SIG2 0.17: v45.12,20.34 45.02,20.44 44.42,20.44 44.07,20.79 U50.63
D15  (via drill 0.3)
  SIG1 0.17: U1.59 44.49,20.04 44.84,19.69 45.87,19.69 v46.02,19.84
  SIG2 0.17: v46.02,19.84 46.02,20.36 45.37,21.02 U50.65
D+
  SIG1 0.15: SODIMM1.71 26.75,2.75 25.4,4.1 25.4,10.23 26.41,11.24 U1.124
D-
  SIG1 0.15: SODIMM1.69 26.15,2.85 25,4 25,10.32 26.32,11.64 U1.123
DCDC_VDDA
  SIG1 0.15: C8.2 23.74,16.83 U1.110 29.44,16.84 29.9,17.3 30.1,17.3 30.3,17.5 30.3,21.2 29.42,22.08 U1.96
  SIG1 0.17: C22.2 C20.2 29.42,23.7 U1.96
DCDC_VDDD  (via drill 0.25 pad 0.25)
  SIG1 0.15: 23.7,7.55 v23.7,7.4 23.7,6.03 C1.2 | 30.45,27.2 30.45,28.65 v30.4,28.7 30.9,29.2 30.9,30 31.55,30.65 C27.2
  SIG1 0.17: 30.45,24.77 30.45,27.2 | 29.42,7.68 U1.1 28.09,8.09 v28.07,8.11 | v9.88,10.34 C5.2 | 31.5,31.61 C27.2 C28.2
  SIG1 0.2: U1.94 U1.93 30.45,23.76 30.45,24.77
  POWER 0.15: v28.07,8.11 30.9,10.94 30.9,19.2 30.4,19.7 v30.4,28.7 | v23.7,7.4 24.4,8.1 24.4,8.11
  POWER 0.17: v28.07,8.11 24.4,8.11 12.11,8.11 v9.88,10.34
DCDC_VDDIO
  SIG1 0.17: 29.82,25.84 29.82,27.43 28.8,28.45 C23.2
  SIG1 0.2: U1.95 29.82,25.84
  SIG1 0.406: C23.2 C24.2 C25.2 R9.2
DEBUG  (via drill 0.25 pad 0.25)
  SIG1 0.15: U1.89 32.22,26.22 36.2,30.2 v36.2,32.2 | v10,3.4 10,1.45 SODIMM1.27
  GND 0.15: v36.2,32.2 27.9,32.2 11.2,15.5 11.2,7.2 10,6 v10,3.4
DQM0  (via drill 0.3)
  SIG1 0.17: U1.46 42.32,14.84 v42.02,14.54
  SIG2 0.17: 33.72,9.96 33.72,10.94 34.92,12.14 36.82,12.14 39.22,14.54 v42.02,14.54
  SIG2 0.2: U50.20 33.72,9.96
DQM1  (via drill 0.25 pad 0.25)
  SIG1 0.17: U1.56 42.42,18.84 42.12,19.14 42.12,22.44 42.72,23.04 v43.27,23.04
  SIG2 0.15: 43.49,26.19 42.78,26.9 35.25,26.9 34.54,26.19
  SIG2 0.17: U50.47 33.67,25.32 34.54,26.19 | v43.27,23.04 43.27,23.19 44.02,23.94 44.02,25.66 43.49,26.19
DQS0  (via drill 0.3)
  SIG1 0.17: v37.97,12.04 U1.39
  SIG2 0.17: U50.16 36.27,10.89 37.42,12.04 v37.97,12.04
DQS1  (via drill 0.3)
  SIG1 0.17: U1.40 38.62,12.44 38.32,12.74 37.42,12.74 36.82,12.14 35.65,12.14 32.92,14.87 32.92,18.24 34.87,20.19 v34.87,20.39
  SIG2 0.17: v34.87,20.39 35.87,20.39 36.27,20.79 U50.51
GND  (via drill 0.25 pad 0.25, 0.3 pad 0.3, 0.6 pad 0.61)
  SIG1 0.15: C4.2 C5.1 R1.2 | R1.2 11.41,8.44 T1.2 14.8,6.82 14.8,5.6 | C16.1 C15.1 C9.1 12.44,15.84 v13.05,15.23 13.05,14.16 T2.1 T2.2 13.61,11.7 15.5,11.7 16.5,10.7 16.5,9.8 17.23,9.07 C2.1 | U1.118 26.33,13.63 26.1,13.86 v25.28,13.86 | C10.1 C11.1 C12.1 | RN2.8 11.21,6.97 R1.2 | C6.1 48.78,16.88 v50.1,18.2 | C3.1 v21,7.4 | U1.112 26.76,16.04 26.3,16.5 24.8,16.5 v24.1,15.8 | U1.105 26.96,18.84 26.4,19.4 v25,19.4 | RN2.6 RN2.5 | U1.35 44.86,10.44 45.9,9.4 | 45.9,9.4 v45.9,7.4 | U1.30 41,8.07 41,6.5 42.9,4.6 v43.2,4.6 | 45.9,9.4 49.8,9.4 v51.3,10.9 | 14.8,5.6 v14.8,3.4 | C1.1 21.45,5.6 14.8,5.6 | C25.1 v23.1,31.6 | v34.5,34 33.86,33.36 C28.1 | v60.9,27.3 60.9,29.84 U2.6 60.96,31.16 61.4,31.6 | U2.GND3 63,31.6 61.4,31.6 | U2.GND1 51.25,34 58.4,34 60.8,31.6 61.4,31.6
  SIG1 0.17: RN2.8 RN2.7 RN2.6 | 22.2,16.99 21.78,16.57 v21.78,16.53 21.74,16.53 C8.1 | C20.1 C22.1 24.53,26.88 v24.35,26.7 | C21.1 13.81,25.73 11.09,23.01 11.09,20.28 11.49,19.88 C16.1 12.34,19.98 | v20.93,23.57 20.69,23.33 C18.1 | U1.98 26.95,21.64 26.3,22.29 v26.3,23.22 | R3.2 4.58,11.08 C4.2 | C24.1 26.18,30.05 24.96,30.05 24.54,29.62 24.54,28.93 25.01,28.45 C23.1 | v50.1,18.2 51.09,18.2 C10.1
  SIG1 0.2: C3.1 19.76,7.2 17.7,7.2 17.23,7.67 C2.1 | C18.1 C19.1 | C8.1 18.35,15.2 C7.1 C13.1 18.34,17.88 C17.1 | 22.2,16.99 C14.1
  SIG1 0.25: C6.1 48.89,13.3 v50.3,13.3 | C10.1 51.7,17.59 v51.7,21.9
  SIG1 0.254: v34.5,34 39.47,34 R10.1 | R2.1 51.68,10.52 v51.3,10.9
  SIG1 0.406: C25.1 C24.1 | C23.1 C22.1 | C26.1 31.55,33.33 C27.1 C28.1
  POWER 0.15: v24.1,15.8 23.37,16.53 v21.78,16.53 | v24.1,15.8 24.1,14.4 24.64,13.86 v25.28,13.86 | v24.1,15.8 25.4,17.1 26.7,17.1 27,17.4 27,19.3 26.9,19.4 v25,19.4
  GND 0.15: v13.05,15.23 13.55,15.23 13.59,15.19 | v25.28,13.86 25.12,13.86 25.1,13.84 24.95,13.84 | v27.5,7.4 27.3,7.2 27.1,7.2 | 25.5,23.1 26.18,23.1 v26.3,23.22 37.02,23.22 v38.7,24.9 | v25,19.4 24.8,19.2 24.6,19.2 | v14.8,3.4 17.6,6.2 19.2,6.2 20.4,7.4 v21,7.4 | v38.7,24.9 41.1,24.9 42,24 v42.4,24 42.4,23 43.63,21.77 U50.64 45.55,22.6 v49.3,22.6 | v38.5,26.2 38.7,26 v38.7,24.9 | v23.1,31.6 22.5,32.2 22.5,34.1 22.9,34.5 34.1,34.5 34.5,34.1 v34.5,34 | 51.5,9.7 51.3,9.9 v51.3,10.9
  GND 0.17: v51.7,21.9 60.91,21.9 v61.9,20.9
  GND 0.406: v58,5 55,5 51.5,8.5 51.5,9.7
  SIG2 0.15: v50.1,18.2 C55.1 48.72,18.28 48.7,18.3 48.7,22.6 | C53.1 48.81,13.3 v50.3,13.3 | v21.78,16.53 19.83,16.53 19.4,16.1 19.4,13.79 C54.1 v21,7.4 21.7,8.1 26.8,8.1 v27.5,7.4 33.02,7.4 R50.2 | 25.2,21.75 U50.34 25.22,19.62 v25,19.4 | v51.3,10.9 51.16,10.9 C52.1 | U50.66 46.02,22.72 46.3,23 | 46.3,23 48.3,23 48.7,22.6 | U50.64 44.7,21.79 44.7,22.6 45.1,23 46.3,23 | U50.52 36.9,21.75 36.9,20.4 | 34.3,21.79 U50.48 34.4,21.84 34.4,23.6 37,26.2 v38.5,26.2 | U50.58 40.8,21.79 40.8,22.9 41.9,24 v42.4,24 | 37.34,23.85 37.2,24 37.2,24.4 37.7,24.9 v38.7,24.9 39.5,24.9 | v49.3,22.6 48.7,22.6 | 44.1,8 45.3,8 v45.9,7.4 45.9,7 45.7,6.8 45.4,6.8 v43.2,4.6 39.72,4.6 39,5.32 C50.1 38.77,5.55 39.5,5.55 40,6.05 40,8 39.35,8.65 39.05,8.65 38.87,8.83 U50.12 | 44.1,8 43.85,8 42.77,9.08 U50.6 | C51.1 44.1,7.43 44.1,8 | v60.9,27.3 59.2,25.6 59,25.6 58.9,25.5 58.8,25.5
  SIG2 0.17: C57.1 R53.1 | U50.34 23.41,23.57 | 23.41,23.57 v20.93,23.57 | 23.41,23.57 23.62,23.78 | 23.62,23.78 24.35,24.5 v24.35,26.7 | v26.3,23.22 25.74,23.78 23.62,23.78 | C59.1 58.13,25.5 58.8,25.5 60,24.3 60,21.9 61,20.9 v61.9,20.9
  SIG2 0.25: v50.3,13.3 50.3,10.04 C52.1 | R53.1 51.7,24.12 v51.7,21.9
  SIG2 0.4: 36.92,23.64 U50.52
  SIG2 0.406: SODIMM1.194 SODIMM1.192 SODIMM1.190 62.4,1.65 62.4,3.3 60.7,5 v58,5
  SIG2 0.5: 36.92,23.64 C56.1 37.34,23.85
  pour GND (isolate 1.27): 0,34.92 0,0 67.94,0 67.94,34.92
  pour SIG2 (isolate 1.27): 0,34.92 0,3.17 67.94,3.17 67.94,34.92
  pour SIG1 (isolate 1.27): 0,34.92 0,3.81 67.94,3.81 67.94,34.92
HP_VGND  (via drill 0.25 pad 0.25)
  SIG1 0.15: v19.6,3.3 19.55,3.25 SODIMM1.47 | U1.111 29.84,16.44 v30.2,16.8
  GND 0.15: v30.2,16.8 30.3,16.8 30.6,16.5 30.6,7.1 31,6.7 31,4.6 27.8,1.4 20.2,1.4 19.6,2 v19.6,3.3
HPL  (via drill 0.25 pad 0.25)
  SIG1 0.15: U1.113 26.06,15.64 v25.7,16 | v20.7,3.1 20.75,3.05 SODIMM1.51
  GND 0.15: v25.7,16 25.2,16.5 23.4,16.5 22.4,15.5 22.4,5.9 20.7,4.2 v20.7,3.1
HPR  (via drill 0.25 pad 0.25)
  SIG1 0.15: U1.109 24.96,17.24 v24.7,17.5 | v18.3,3.5 18.35,3.45 SODIMM1.43
  GND 0.15: v18.3,3.5 18.3,1.45 19.05,0.7 28.8,0.7 33.2,5.1 33.2,14 33,14.2 33,15.6 31,17.6 29.6,17.6 29.24,17.24 24.96,17.24 v24.7,17.5
LED1  (via drill 0.25 pad 0.25)
  SIG1 0.15: U1.88 32.62,26.02 v37.8,31.2 | v11.1,3.5 11.15,3.45 SODIMM1.31
  SIG1 0.254: LED.A v37.8,31.2
  GND 0.15: v37.8,31.2 27.5,31.2 11.7,15.4 11.7,6.5 11.1,5.9 v11.1,3.5
LIN1_INL  (via drill 0.25 pad 0.25)
  SIG1 0.15: SODIMM1.59 23.1,1.45 v23.1,3.5 | U1.115 26.76,14.84 26.3,15.3 v24.8,15.3
  GND 0.15: v23.1,3.5 23.8,2.8 25.5,2.8 26.8,4.1 26.8,14.6 26.1,15.3 v24.8,15.3
LIN1_INR  (via drill 0.25 pad 0.25)
  SIG1 0.15: U1.114 29.44,15.24 v30,15.8 | v22,3.5 21.95,3.45 SODIMM1.55
  GND 0.15: v30,15.8 30,8.5 27.3,5.8 27.3,2.9 26.2,1.8 22.9,1.8 22,2.7 v22,3.5
N$1
  SIG1 0.15: D03_H.1 2.74,4.45 RN1.8
N$3
  SIG1 0.254: 40.2,30.5 LED.C 40.09,31.25 41.82,32.98 R10.2
N$4
  SIG1 0.254: PLED.C 54.88,10.9 R2.2
N$7  (via drill 0.3 pad 0.3)
  SIG1 0.17: v42.36,25.5 47.01,25.5 v47.23,25.72
  SIG2 0.15: C57.2 49.72,25.72 v47.23,25.72
  SIG2 0.17: U50.49 34.97,23.39 37.08,25.5 v42.36,25.5 | C57.2 R53.2 R54.2 C58.2
N$18
  SIG1 0.17: L1.2 7.96,27.62 21.36,27.62 25.03,23.95 26.92,23.95 27.87,23 U1.97
  SIG1 0.2: 27.45,22.04 U1.97
N$19
  SIG1 0.17: L1.1 8,21.17 13.77,26.94 20.95,26.94 26.65,21.24 U1.99
N$25
  SIG1 0.15: C7.2 17.51,14.35 17.81,14.05 23.55,14.05 23.85,14.35 25.1,14.35 25.2,14.45 26.02,14.45 26.43,14.04 U1.117
N$38
  SIG1 0.17: R4.2 C4.1
N$43
  SIG1 0.17: R6.1 R1.1 T1.1
N$103
  SIG1 0.15: D02_H.1 4.04,5.07 RN1.7
N$104
  SIG1 0.15: D01_H.1 4.03,6.25 RN1.6
N$105
  SIG1 0.15: D00_H.1 3.62,7.45 RN1.5
PIN1/LCD_D00  (via drill 0.25 pad 0.25)
  SIG1 0.15: U1.2 29.82,6.7 v29.2,6.7 28.6,6.7 27.5,5.6 27.5,5.3 29.7,3.1 29.7,1.59 29.82,1.47 SODIMM1.81 | RN1.4 5.53,6.8 v7.5,6.8 9.79,6.8 RN2.1
  SIG2 0.15: v7.5,6.8 7.6,6.7 v29.2,6.7
PIN2/LCD_D01  (via drill 0.25 pad 0.25)
  SIG1 0.15: RN1.3 5.53,6 v7.3,6 9.79,6 RN2.2 | U1.3 30.2,8.07 30.2,6.5 29.7,6 v29,6 28.6,6 28.1,5.5 28.1,5.3 30.3,3.1 30.3,1.45 SODIMM1.83
  SIG2 0.15: v29,6 v7.3,6
PIN3/LCD_D02  (via drill 0.25 pad 0.25)
  SIG1 0.15: SODIMM1.85 30.9,1.45 30.9,3.4 29.2,5.1 v29.2,5.3 29.6,5.3 30.62,6.32 U1.4 | RN1.2 5.53,5.3 v8.1,5.3 9.79,5.3 RN2.3
  SIG2 0.15: v29.2,5.3 29,5.1 8.3,5.1 v8.1,5.3
PIN4/LCD_D03  (via drill 0.25 pad 0.25)
  SIG1 0.15: SODIMM1.87 31.5,1.45 31.5,3.5 30.3,4.7 v30.3,5.2 31.02,5.92 U1.5 | RN1.1 5.53,4.4 v6.8,4.4 9.79,4.4 RN2.4
  SIG2 0.15: v6.8,4.4 7.1,4.7 29.8,4.7 v30.3,5.2
PIN5/LCD_D04
  SIG1 0.15: SODIMM1.89 32.15,3.55 30.9,4.8 30.9,5.2 31.42,5.72 U1.6
PIN6/LCD_D05  (via drill 0.25 pad 0.25)
  SIG1 0.15: U1.7 31.8,8.07 31.8,5.2 v31.6,5 31.6,4.8 32.75,3.65 SODIMM1.91
  SIG2 0.15: v31.6,5 32.22,5.62 R50.1
PIN7/LCD_D06
  SIG1 0.15: U1.8 32.22,4.68 33.35,3.55 SODIMM1.93
PIN8/LCD_D07
  SIG1 0.15: U1.9 32.62,4.78 33.95,3.45 SODIMM1.95
PIN9/LCD_D08/SSP2_MISO
  SIG1 0.15: U1.22 37.8,8.07 37.8,5.9 40.55,3.15 SODIMM1.117
PIN10/LCD_D09
  SIG1 0.15: U1.23 38.2,8.07 38.2,6 41.15,3.05 SODIMM1.119
PIN11/LCD_D10
  SIG1 0.15: U1.24 38.62,6.08 41.75,2.95 SODIMM1.121
PIN12/LCD_D11
  SIG1 0.15: U1.25 39,8.07 39,6.2 42.35,2.85 SODIMM1.123
PIN13/LCD_D12
  SIG1 0.15: U1.27 39.8,8.07 39.8,6.5 43.55,2.75 SODIMM1.127
PIN14/LCD_D13
  SIG1 0.15: U1.26 39.4,8.07 39.4,6.4 42.95,2.85 SODIMM1.125
PIN15/LCD_D14
  SIG1 0.15: U1.29 40.6,8.07 40.6,7 40.3,6.7 40.3,6.6 44.15,2.75 SODIMM1.129
PIN17/LCD_D16/USB_FLAG
  SIG1 0.15: SODIMM1.113 39.35,3.15 36.2,6.3 36.2,6.7 36.6,7.1 36.6,8.07 U1.19
PIN18/LCD_D17/USB_EN
  SIG1 0.15: 37,8.07 U1.20 37,8.07 37,7.05 36.6,6.65 36.6,6.4 39.95,3.05 SODIMM1.115
PIN19/LCD_DOTCLK
  SIG1 0.15: U1.17 35.82,6.18 38.6,3.4 38.6,1.55 SODIMM1.111
PIN20/LCD_VSYNC
  SIG1 0.15: U1.16 35.4,8.07 35.4,5.91 37.37,3.94 37.49,3.94 38.15,3.28 SODIMM1.109
PIN21/LCD_HSYNC/I2C_SDA
  SIG1 0.15: U1.15 35.02,5.68 37.17,3.54 37.39,3.54 37.55,3.37 SODIMM1.107 37.6,1.45
PIN22/LCD_EN/I2C_SCL
  SIG1 0.15: 33.4,8.07 U1.11 33.42,4.98 35.15,3.25 SODIMM1.99
PIN23/LCD_DISP
  SIG1 0.15: U1.12 33.82,5.18 35.75,3.25 SODIMM1.101
PIN24/LCD_WR
  SIG1 0.15: U1.13 34.2,8.07 34.2,5.4 36.35,3.25 SODIMM1.103
PIN25/LCD_RS  (via drill 0.25 pad 0.25)
  SIG1 0.15: 34.6,8.07 U1.14 34.62,5.53 36.94,3.21 v36.94,3.01 v36.95,3 SODIMM1.105
  SIG2 0.15: v36.94,3.01 36.94,3.56 35.47,5.03 R51.2
PIN26/LCD_CS
  SIG1 0.15: U1.10 33.02,4.88 34.55,3.35 SODIMM1.97
PIN27/PWM2  (via drill 0.25 pad 0.25)
  SIG1 0.15: U1.91 31.42,27.52 35.1,31.2 v35.1,33 35.2,32.9 | v8.8,3.4 8.75,3.35 SODIMM1.23
  GND 0.15: v35.1,33 28,33 10.7,15.7 10.7,7.6 8.8,5.7 v8.8,3.4
PIN28/SOFT_SDA
  SIG1 0.15: SODIMM1.133 45.3,1.45 45.3,4.1 42.7,6.7 41.9,6.7 41.42,7.18 U1.31
PIN29/SOFT_SCL
  SIG1 0.15: SODIMM1.139 47.15,4.3 44.8,6.65 44.8,9.8 44.56,10.04 U1.34
PIN30
  SIG1 0.15: SODIMM1.141 47.75,6.45 49.5,8.2 54.2,8.2 58.2,12.2 58.2,21 52,27.2 48.2,27.2 47.5,26.5 46.9,26.5 46.4,26 44,26 43.3,26.7 42.6,26.7 41.4,25.5 36.2,25.5 35.42,24.72 U1.81
PIN31
  SIG1 0.15: 48.35,5.95 SODIMM1.143 | U1.82 35.02,24.82 36.2,26 37.5,26 38.4,26.9 39.4,26.9 40.2,26.1 41,26.1 42,27.1 43.6,27.1 44.3,26.4 46.2,26.4 46.8,27 47.1,27 47.9,27.8 52.6,27.8 58.8,21.6 58.8,11.3 55,7.5
  SIG1 0.17: 48.35,5.95 49.9,7.5 55,7.5
PIN32/LRADC1  (via drill 0.25 pad 0.25)
  SIG1 0.15: U1.107 26.26,18.04 v25.9,18.4 | v12.4,3.5 12.35,3.45 SODIMM1.35
  GND 0.15: v25.9,18.4 25.8,18.5 25.8,19.7 25.4,20.1 19.4,20.1 15.2,15.9 15.2,14.9 12.4,12.1 v12.4,3.5
PIN33/LRADC0  (via drill 0.25 pad 0.25)
  SIG1 0.15: U1.108 25.66,17.64 v25.5,17.8 | v13.6,3.5 13.6,1.4 SODIMM1.39
  GND 0.15: v25.5,17.8 24.6,18.7 19.8,18.7 13.6,12.5 v13.6,3.5
PIN34/MIC  (via drill 0.25 pad 0.25)
  SIG1 0.15: SODIMM1.67 25.55,2.65 24.7,3.5 v24.4,3.5 | U1.116 26.61,14.44 26.15,14.9 25.15,14.9 25,14.75 24.01,14.75 23.57,15.2 v23.5,15.2
  GND 0.15: v24.4,3.5 26.4,5.5 26.4,14.2 25.9,14.7 24,14.7 v23.5,15.2
POWER/REC  (via drill 0.3)
  SIG1 0.15: R3.1 4.5,14.2 3.6,14.2 3.1,13.7 3.1,11.3 2.3,10.5 v2.3,10.3 | v3.3,3.4 3.5,3.2 5.6,3.2
  SIG1 0.17: R5.1 7.02,14.31 R4.1 4.62,14.32 R3.1
  SIG1 0.2: SODIMM1.13 5.8,1.45 5.8,3 5.6,3.2
  GND 0.15: v2.3,10.3 2.2,10.2 2.2,5.6 3.3,4.5 v3.3,3.4
PSWITCH  (via drill 0.25 pad 0.25)
  SIG1 0.15: U1.119 v25.7,13.25
  SIG1 0.17: U1.119 | v9.85,12.38 8.87,12.38 8.69,12.56 R5.2
  POWER 0.15: v25.7,13.25 24.25,11.8 16.6,11.8 16.02,12.38 v9.85,12.38
PWM0/DUART_RXD
  SIG1 0.15: U1.125 26.54,10.84 25.8,10.1 25.8,4.3 27.3,2.8 27.3,1.45 SODIMM1.73
PWM1/DUART_TXD
  SIG1 0.15: SODIMM1.75 27.9,1.45 27.9,2.7 26.1,4.5 26.1,9.8 26.74,10.44 U1.126
RASN  (via drill 0.3)
  SIG1 0.2: U1.62 44.45,21.24 44.65,21.44 46.22,21.44 46.62,21.04 v47.42,21.04
  SIG2 0.17: U50.23 31.72,10.84 34.82,13.94 37.42,13.94 39.22,15.74 44.82,15.74 47.12,18.04 47.12,20.74 v47.42,21.04
RESET  (via drill 0.3, 0.6)
  SIG1 0.2: R6.2 9.03,16.5 v4.2,16.5 | v7.6,3.5 6.6,3.5 6.35,3.25 SODIMM1.15
  SIG1 0.254: v10.21,30.53 9.09,29.41 RST.4
  GND 0.2: v4.2,16.5 3.1,15.4 3.1,6.9 6.5,3.5 v7.6,3.5
  GND 0.254: v10.21,30.53 4.2,24.52 v4.2,16.5
SSP1_CMD  (via drill 0.3, 0.3 pad 0.3)
  SIG1 0.15: U1.83 34.62,25.12 35.9,26.4 37.2,26.4 38.3,27.5 | v57.7,28 57.66,28.04 U2.3
  SIG1 0.17: U1.83 34.6,23.61 | 38.3,27.5 43.7,27.5 43.8,27.6 | 43.8,27.6 43.8,28.5 R8.1 | 43.8,27.6 45.2,27.6 v45.6,27.2
  SIG1 0.2: SODIMM1.181 59.74,6.04 64.75,11.05 v64.75,13.61
  GND 0.15: v45.6,27.2 46.5,28.1 52.2,28.1 53.6,29.5 57.1,29.5 57.7,28.9 v57.7,28
  GND 0.2: v64.75,13.61 63.02,15.34 63.02,21.79 59.66,25.15 58.42,25.15 57.7,25.87 v57.7,28
SSP1_DATA0  (via drill 0.3)
  SIG1 0.15: U1.84 34.2,23.61 34.2,25.2 35.8,26.8 37,26.8 38.2,28 41.9,28 42.1,28.2 v42.4,28.2 42.4,30 42.95,30.55 RN3.8 | v53.5,28.2 56.9,24.8 61.9,24.8 62.06,24.96 U2.7
  SIG1 0.2: SODIMM1.185 60.94,1.42 60.94,4.93 61.39,5.38 63.25,5.38 65.08,7.21 65.08,9.07 66.22,10.21 v66.22,15.9 | v62.36,24.03 62.06,24.33 62.06,24.96
  SIG2 0.15: v42.4,28.2 v53.5,28.2
  SIG2 0.2: v66.22,15.9 63.42,18.69 63.42,22.96 v62.36,24.03
SSP1_DATA1  (via drill 0.3, 0.3 pad 0.3)
  SIG1 0.15: U1.85 33.82,25.42 35.6,27.2 36.8,27.2 38.3,28.7 41.2,28.7 41.7,29.2 41.7,30.3 42.7,31.3 v43.3,31.3 43.35,31.35 RN3.7 | U2.8 63.2,29.66 v63.2,28.1
  SIG1 0.2: SODIMM1.187 61.52,1.43 61.52,3.63 62.43,4.55 64.21,4.55 65.56,5.89 v66.12,5.89
  POWER 0.15: v63.2,28.1 61.1,30.2 54.4,30.2 53.3,31.3 v53.1,31.3
  GND 0.2: v66.12,5.89 66.47,6.25 66.47,13.82 63.96,16.33 63.96,24.66 63.2,25.42 v63.2,28.1
  SIG2 0.15: v53.1,31.3 v43.3,31.3
SSP1_DATA2  (via drill 0.3)
  SIG1 0.15: 44.41,32.1 arc90 RN3.6 43.75,32.15 43.4,32.5 | U1.86 33.42,25.52 35.5,27.6 36.6,27.6 38.2,29.2 40.6,29.2 41,29.6 41,31 42.5,32.5 43.4,32.5 | 43.8,33.6 43.4,33.2 43.4,32.5
  SIG1 0.17: U2.1 55.5,29.74 55.5,32.9 54.8,33.6 53.4,33.6 51.8,32 50.1,32 48.3,33.8 44,33.8 43.8,33.6
  SIG1 0.2: SODIMM1.177 58.57,1.42 58.57,3.53 58.24,3.86 57.1,3.86 56.64,4.32 56.64,7.72 59.31,10.39 59.31,22.58 v59.08,22.81 | v55.45,28.09 55.46,28.1 U2.1
  GND 0.2: v59.08,22.81 55.45,26.44 v55.45,28.09
SSP1_DATA3  (via drill 0.3, 0.3 pad 0.3)
  SIG1 0.15: U1.87 33.02,25.72 35.7,28.4 v36.2,28.4
  SIG1 0.17: U2.2 56.6,29.34 v56.6,31.2
  SIG1 0.2: SODIMM1.179 59.16,6.73 63.8,11.38 63.8,26.9 64.52,27.61 v64.52,29.67
  SIG2 0.15: v36.2,28.4 36.2,30.7 38.3,32.8 55,32.8 v56.6,31.2
  SIG2 0.2: v56.6,31.2 56.71,31.2 58.24,29.67 v64.52,29.67
SSP1_SCK  (via drill 0.3, 0.3 pad 0.3)
  SIG1 0.15: U1.90 31.82,26.92 v34.8,29.9 | v59.8,31.3 59.86,31.24 U2.5
  SIG1 0.2: SODIMM1.183 | SODIMM1.183 60.35,5.64 60.78,6.07 63.02,6.07 63.98,7.04 63.98,9.09 65.56,10.67 65.56,15.11 64.54,16.13 64.54,26.19 65.68,27.33 v65.68,30.81
  SIG2 0.15: v34.8,29.9 38.4,33.5 | 58.3,33.6 59.8,32.1 v59.8,31.3
  SIG2 0.17: 38.4,33.5 38.5,33.6 58.3,33.6
  SIG2 0.2: v65.68,30.81 65.19,31.3 v59.8,31.3
SSP2_MOSI  (via drill 0.25 pad 0.25)
  SIG1 0.15: U1.21 37.4,8.07 37.4,6.6 v37.3,6.5 | SODIMM1.131 44.7,1.45 44.7,3.5 44.2,4 v44.2,4.2
  SIG2 0.15: v37.3,6.5 37.3,5.8 39.1,4 44,4 v44.2,4.2
SSP2_SCK
  SIG1 0.15: SODIMM1.137 46.5,1.45 46.5,4.1 43.37,7.23 U1.33
VDD4P2
  SIG1 0.17: SCHOTTKY1.C 16,21.26 19.25,21.26 20.56,19.95 C18.2
  SIG1 0.2: U1.101 22.97,20.43 C19.2 C18.2
VDDXTAL  (via drill 0.25 pad 0.25)
  SIG1 0.15: U1.120 26.14,12.84 25.9,12.6 25.5,12.6 25.2,12.9 24.3,12.9 v23.8,12.4 | v14.5,15.3 14.14,15.66 C9.2
  POWER 0.15: v23.8,12.4 17.4,12.4 v14.5,15.3
WEN  (via drill 0.3)
  SIG1 0.17: U1.77 37.02,21.84 35.82,20.64 35.82,20.34 33.32,17.84 33.32,15.04 35.52,12.84 v35.92,12.84
  SIG2 0.17: U50.21 33.02,10.94 34.92,12.84 v35.92,12.84
XTALI
  SIG1 0.15: 22.31,9.65 23.45,9.65 23.7,9.9 23.7,11 24.12,11.42 25.65,11.42 26.27,12.04 U1.122
  SIG1 0.17: 22.71,8.31 C3.2 22.71,7.5 21.82,6.61 16.74,6.61 15.38,7.97 T1.3
  SIG1 0.2: Q1.3 19.92,10.71 20.98,9.65 22.31,9.65 22.71,9.25 C3.2
XTALO
  SIG1 0.15: U1.121 26.24,12.44 26.1,12.3 24.5,12.3 24.1,11.9 23.31,11.9 Q1.1
  SIG1 0.17: T2.3 16.98,11.48 16.98,11.14
  SIG1 0.2: C2.2 18.83,8.55 18.83,9.35 18.5,9.68 17.39,9.68 16.98,10.09 16.98,11.14 17.72,11.88 20.18,11.88 21.31,13.01 Q1.1